# Altium schematic sheet Ethernet.SchDoc
size A4
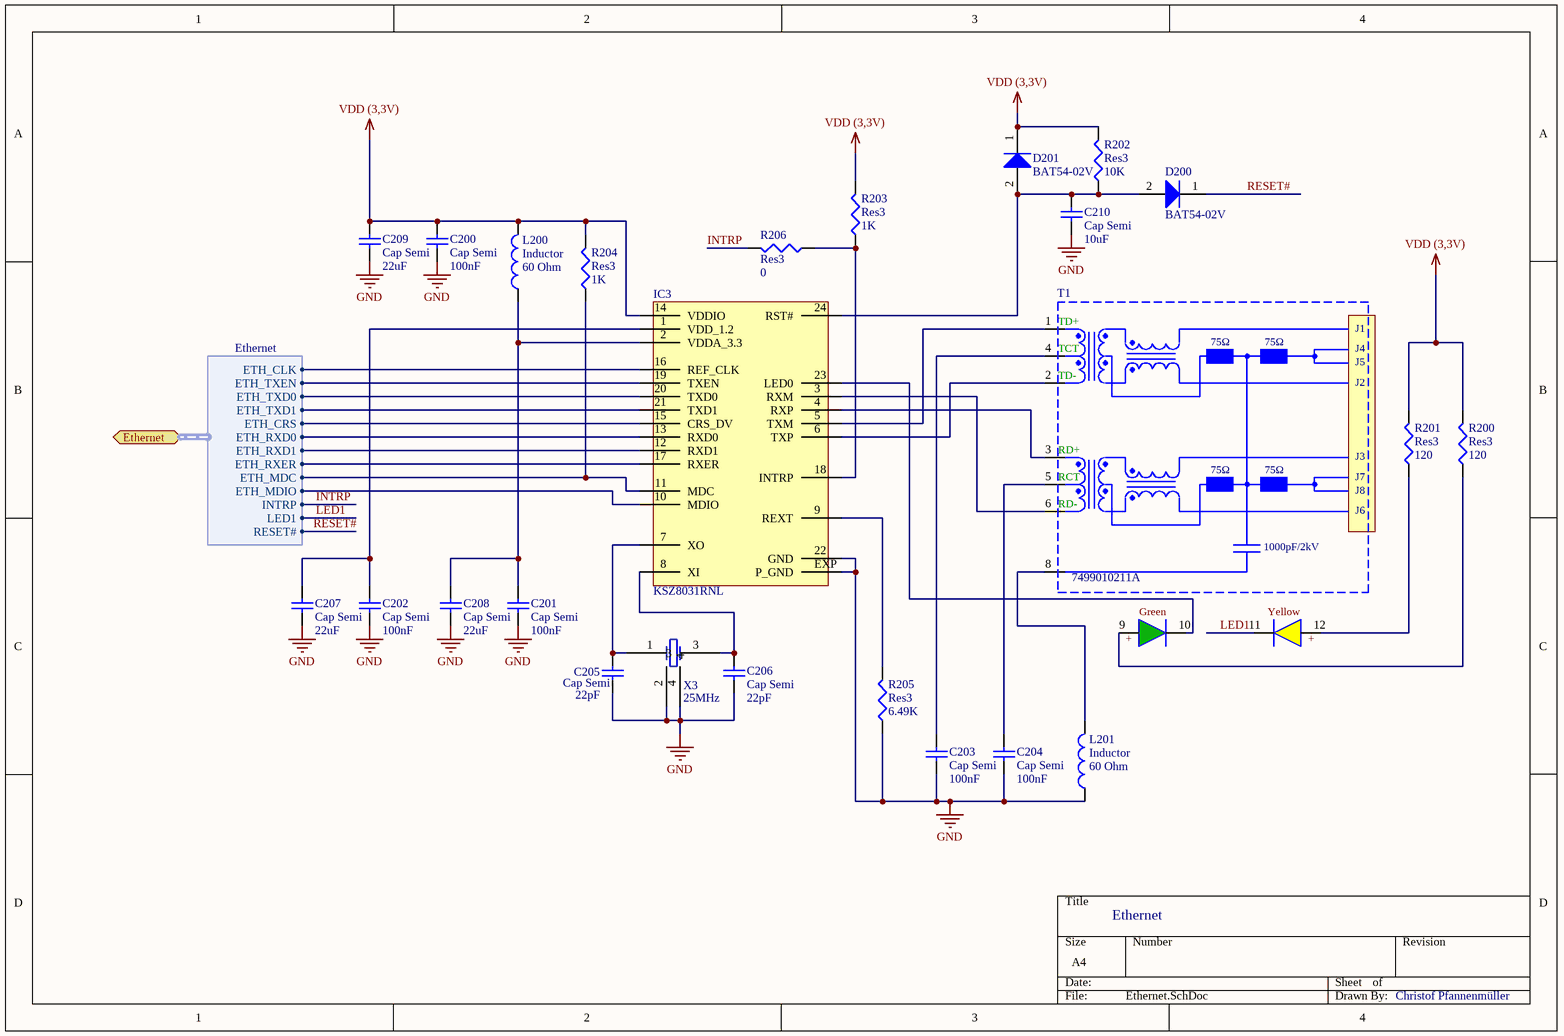
[diagram p0: Ethernet.SchDoc]

## Parts
C200  Cap Semi  value 100nF  [0402]
C201  Cap Semi  value 100nF  [0402]
C202  Cap Semi  value 100nF  [C1206]
C203  Cap Semi  value 100nF  [C1206]
C204  Cap Semi  value 100nF  [C1206]
C205  Cap Semi  value 22pF  [0402]
C206  Cap Semi  value 22pF  [0402]
C207  Cap Semi  value 22uF  [C1206]
C208  Cap Semi  value 22uF  [C1206]
C209  Cap Semi  value 22uF  [C1206]
C210  Cap Semi  value 10uF  [C1206]
D200  BAT54-02V  [INF-SC79_V]
D201  BAT54-02V  [INF-SC79_V]
IC3  KSZ8031RNL  [QFN /MLF 24pin]
L200  Inductor  value 60 Ohm  [0603]
L201  Inductor  value 60 Ohm  [0603]
R200  Res3  value 120  [J1-0603]
R201  Res3  value 120  [J1-0603]
R202  Res3  value 10K  [J1-0603]
R203  Res3  value 1K  [J1-0603]
R204  Res3  value 1K  [J1-0603]
R205  Res3  value 6.49K  [J1-0603]
R206  Res3  value 0  [J1-0603]
T1  7499010211A  [7499010211A]
X3  25MHz  [Quarz]

## Ports
Ethernet (harness Ethernet)

## Harnesses
Ethernet: ETH_CLK, ETH_TXEN, ETH_TXD0, ETH_TXD1, ETH_CRS, ETH_RXD0, ETH_RXD1, ETH_RXER, ETH_MDC, ETH_MDIO, INTRP, LED1, RESET#

## Nets
GND: C200.1 C201.1 C202.1 C203.1 C204.1 C205.1 C206.1 C207.1 C208.1 C209.1 C210.1 IC3.22(GND) IC3.EXP(P_GND) L201.1 R205.1 X3.2 X3.4
VDD (3,3V): C200.2 C209.2 D201.1(K) IC3.14(VDDIO) L200.2 R200.2 R201.2 R202.2 R203.2 R204.2
INTRP: R206.2 ; port Ethernet.INTRP
LED1: T1.11 ; port Ethernet.LED1
RESET#: D200.1(K) ; port Ethernet.RESET#
NetC201_2: C201.2 C208.2 IC3.2(VDDA_3.3) L200.1
NetC202_2: C202.2 C207.2 IC3.1(VDD_1.2)
NetC203_2: C203.2 T1.4(RD+)
NetC204_2: C204.2 T1.5(RCT)
NetC205_2: C205.2 IC3.7(XO) X3.1
NetC206_2: C206.2 IC3.8(XI) X3.3
NetC210_2: C210.2 D200.2(A) D201.2(A) IC3.24(RST#) R202.1
NetIC3_3: IC3.3(RXM) T1.6(RD-)
NetIC3_4: IC3.4(RXP) T1.3(TD-)
NetIC3_5: IC3.5(TXM) T1.1(TD+)
NetIC3_6: IC3.6(TXP) T1.2(TCT)
NetIC3_9: IC3.9(REXT) R205.2
NetIC3_10: IC3.10(MDIO) ; port Ethernet.ETH_MDIO
NetIC3_11: IC3.11(MDC) R204.1 ; port Ethernet.ETH_MDC
NetIC3_12: IC3.12(RXD1) ; port Ethernet.ETH_RXD1
NetIC3_13: IC3.13(RXD0) ; port Ethernet.ETH_RXD0
NetIC3_15: IC3.15(CRS_DV) ; port Ethernet.ETH_CRS
NetIC3_16: IC3.16(REF_CLK) ; port Ethernet.ETH_CLK
NetIC3_17: IC3.17(RXER) ; port Ethernet.ETH_RXER
NetIC3_18: IC3.18(INTRP) R203.1 R206.1
NetIC3_19: IC3.19(TXEN) ; port Ethernet.ETH_TXEN
NetIC3_20: IC3.20(TXD0) ; port Ethernet.ETH_TXD0
NetIC3_21: IC3.21(TXD1) ; port Ethernet.ETH_TXD1
NetIC3_23: IC3.23(LED0) T1.10
NetL201_2: L201.2 T1.8
NetR200_1: R200.1 T1.9
NetR201_1: R201.1 T1.12

## Notes on the sheet
- Ethernet
- Christof Pfannenmüller
- (in symbol 7499010211A) J1; 75Ω; J4; J5; J2; J3; J7; J8; J6; 1000pF/2kV; Green; Yellow; +

## Library data of the parts
C200-C210 = Cap Semi: Capacitor (Semiconductor SIM Model); Published: 8-Jun-2000; LatestRevisionDate: 29-May-2009; LatestRevisionNote: IPC-7351 Footprint Added.; PackageReference: C1206; Publisher: Altium Limited; PackageDescription: Chip Capacitor
D200 D201 = BAT54-02V: Silicon Schottky Diode, SC79, Reel, Green; Manufacturer: Infineon; Green: TRUE; PackageReference: SC79; PackageDescription: 2-Pin Semiconductor Package, 0.8 x 1.2 mm Body; Supplier 1: Mouser; Supplier Part Number 1: N/A; Halogen-free: FALSE; Mounting Technology: Surface Mount; PartNumber: BAT54-02V; ComponentLink1Description: Manufacturer URL; ComponentLink1URL: http://www.infineon.com/; ComponentLink2Description: Datasheet; ComponentLink2URL: http://www.infineon.com/dgdl/bat54series.pdf?folderId=db3a30431400ef68011425f1ca2505e3&fileId=db3a304314dca3890115190b74210ea6; ComponentLink3Description: Package Specification; ComponentLink3URL: http://www.infineon.com/dgdl/SC79-Package_Overview.pdf?folderId=db3a30431936bc4b011951fbddb03b15&fileId=db3a30431936bc4b01195226fe583b41
L200 L201 = Inductor: Code_IEC: 1005; Published: 8-Jun-2000; LatestRevisionDate: 29-May-2009; LatestRevisionNote: IPC-7351 Footprint Added.; PackageReference: 0402-A; Publisher: Altium Limited; PackageDescription: Chip Inductor; Code_JEITA: 0402
R200-R206 = Res3: Resistor; Published: 8-Jun-2000; LatestRevisionDate: 29-May-2009; LatestRevisionNote: IPC-7351 Footprint Added.; PackageReference: J1-0603; Publisher: Altium Limited; PackageDescription: Chip Resistor
T1 = 7499010211A: RJ45 LAN Transformer, 10/100 Base-T; Manufacturer: Wurth Elektronik; ComponentLink1 Description: Manufacturer; ComponentLink2 Description: Datasheet; ComponentLink1 URL: http://www.we-online.com; ComponentLink2 URL: http://katalog.we-online.de/pbs/datasheet/7499010211A.pdf; Created By: Baojun Chen; Created Date: 14-Aug-15; PartNo: 7499010211A
X3 = Quarz: Value: 25MHz